# Altium schematic sheet POW.SchDoc
size A4; Revision: V1.0.0; SheetNumber: 2; SheetTotal: 6
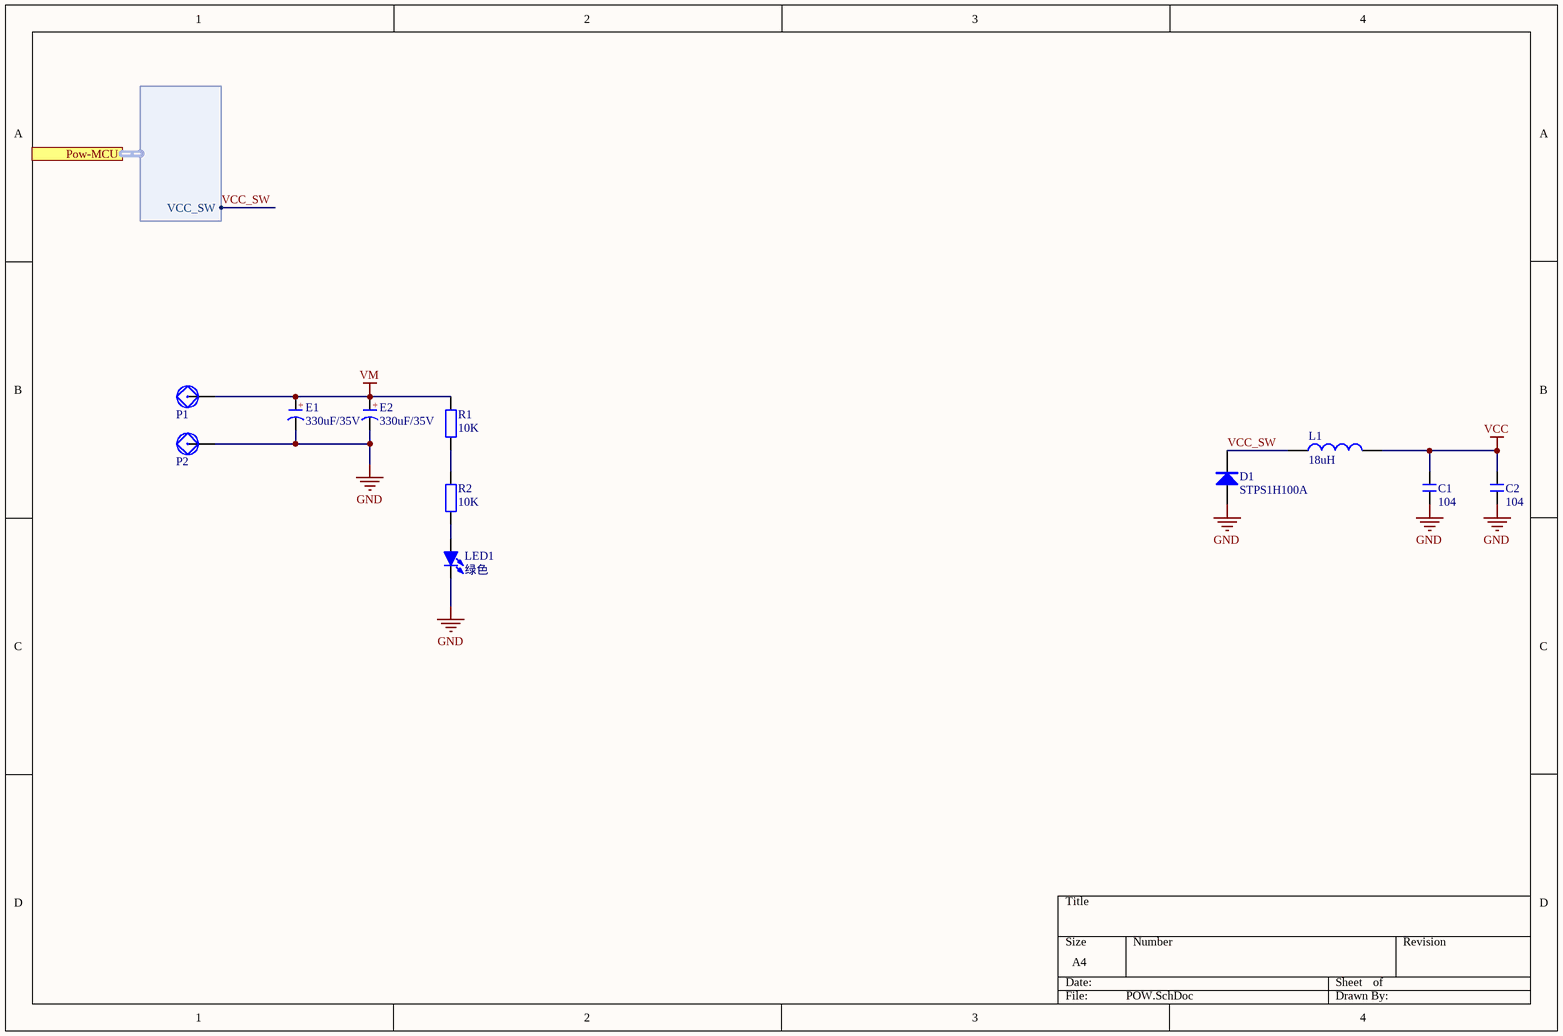
[diagram p0: POW.SchDoc]

## Parts
C1  104  [C 0805_L]
C2  104  [C 0805_L]
D1  STPS1H100A  [SMA]
E1  330uF/35V  [CAP 5.0*10*12.5]
E2  330uF/35V  [CAP 5.0*10*12.5]
L1  18uH  [L 0805]
LED1  绿色  [LED 0603G]
P1  功率焊盘  [功率焊盘]  (value not drawn)
P2  功率焊盘  [功率焊盘]  (value not drawn)
R1  10K  [R 0603_L]
R2  10K  [R 0603_L]

## Ports
Pow-MCU (harness Pow-MCU, see TopLevel[2B], MCU[1A])

## Harnesses
Pow-MCU: VCC_SW

## Nets
GND: C1.1 C2.1 D1.1(A) E1.2(K) E2.2(K) LED1.2(K) P2.1
VCC: C1.2 C2.2 L1.2
VM: E1.1(A) E2.1(A) P1.1 R1.2
VCC_SW: D1.2(K) L1.1 ; port Pow-MCU.VCC_SW
NetLED1_1: LED1.1(A) R2.1
NetR1_1: R1.1 R2.2

## Notes on the sheet
- (in symbol C-CAP) +

## Library data of the parts
C1 C2 = C: 无极性贴片电容; 版权归属: 源创客; BOM名称: 无极性贴片电容; 学习资源: www.ooocke.com
D1 = SS14: 肖特基二极管; 版权归属: 源创客; 属性: 40V/1A; BOM名称: 肖特基二极管; 学习资源: www.ooocke.com
E1 E2 = C-CAP: 直插电解电容; 版权归属: 源创客; BOM名称: 直插电解电容; 学习资源: www.ooocke.com
L1 = L: 小功率贴片电感; 版权归属: 源创客; BOM名称: 小功率贴片电感; 学习资源: www.ooocke.com
LED1 = LED-SMD: 贴片LED; 版权归属: 源创客; BOM名称: 贴片LED; 学习资源: www.ooocke.com
R1 R2 = R: 贴片电阻; 版权归属: 源创客; BOM名称: 贴片电阻; 学习资源: www.ooocke.com